# Altium schematic sheet Icarus_FC_TOP.SchDoc
size A4; SheetNumber: 1; SheetTotal: 1
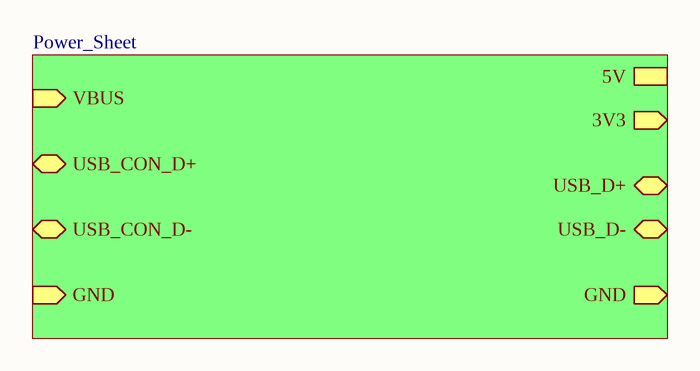
[diagram p0: Icarus_FC_TOP.SchDoc]

## Sub-sheets
POWER = Power_Sheet: VBUS (in), USB_CON_D+ (bidir), USB_CON_D- (bidir), GND (in), 3V3 (out), GND (out), USB_D+ (bidir), USB_D- (bidir), 5V